# Altium project DigitalBuckBoost.PrjPcb
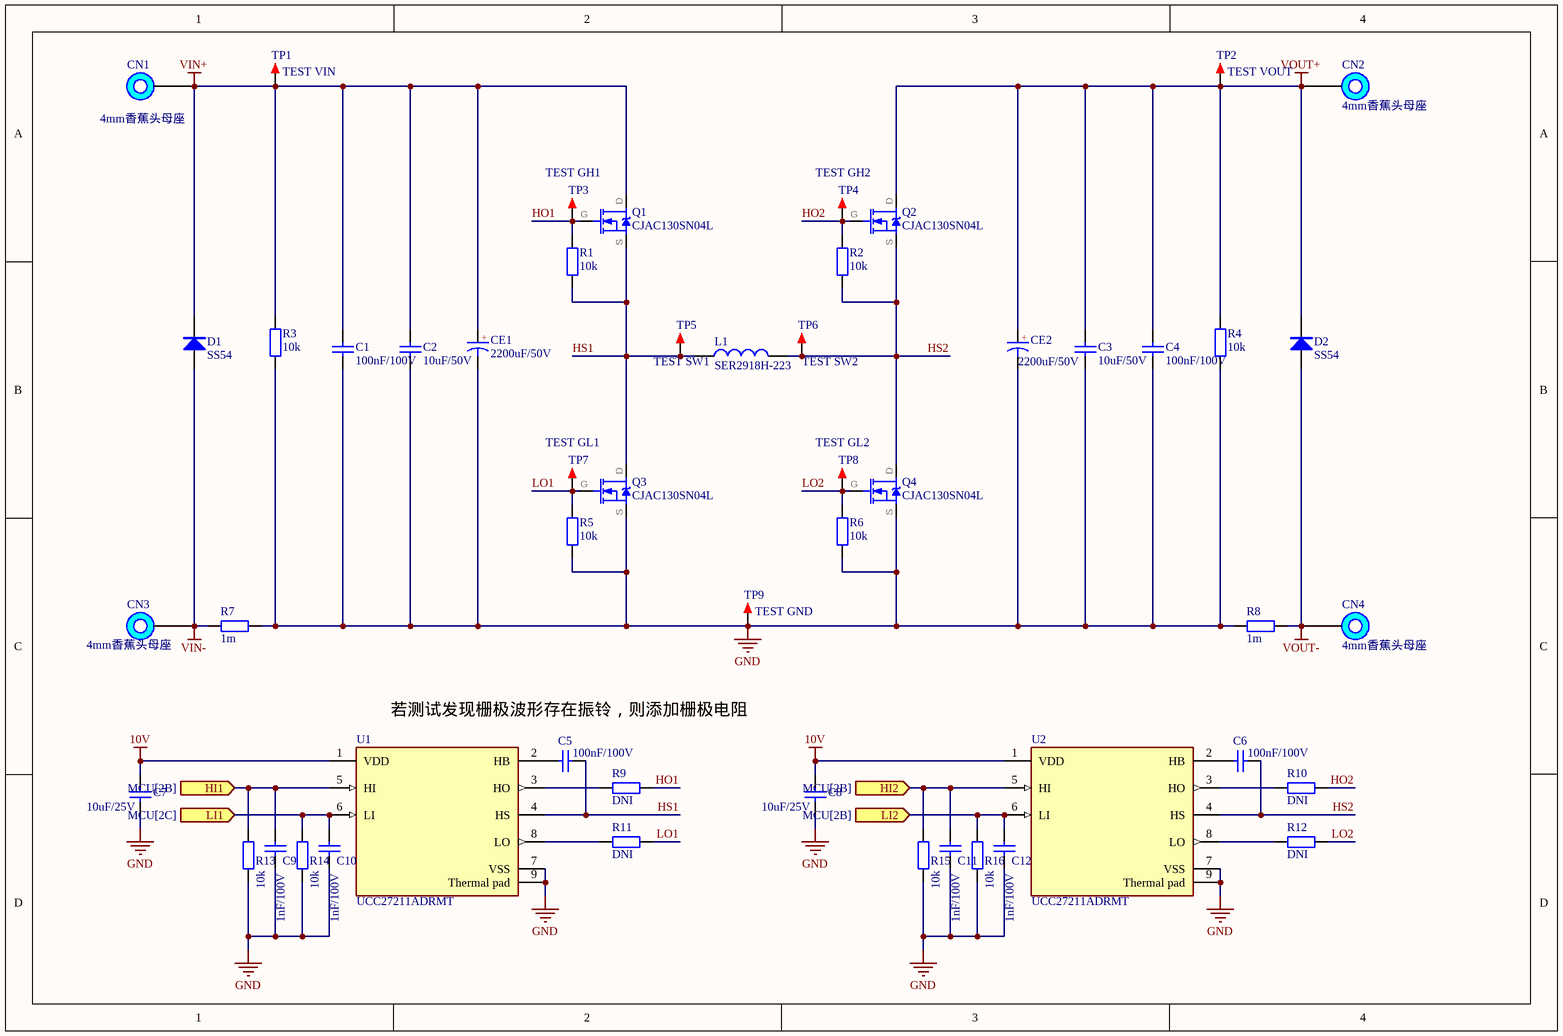
[diagram p0: MainPowerCircuit.SchDoc]
5 sheets, 159 parts. Net scope: flat (ports and power ports of the same name join across sheets).
Board file: DigitalBuckBoost.PcbDoc
Sheets:
  MainPowerCircuit.SchDoc
  AuxiliaryPowerSupply.SchDoc
  MCU.SchDoc
  SignalConditioning.SchDoc
  STLink-V2-1.SchDoc

## Sheet MainPowerCircuit.SchDoc
size A4; SheetNumber: 1; SheetTotal: 5

### Parts
C1  100nF/100V  [C0402_L]
C2  10uF/50V  [C1206_L]
C3  10uF/50V  [C1206_L]
C4  100nF/100V  [C0402_L]
C5  100nF/100V  [C0402_L]
C6  100nF/100V  [C0402_L]
C7  10uF/25V  [C0603_L]
C8  10uF/25V  [C0603_L]
C9  1nF/100V  [C0402_L]
C10  1nF/100V  [C0402_L]
C11  1nF/100V  [C0402_L]
C12  1nF/100V  [C0402_L]
CE1  2200uF/50V  [CE-7.5*16*31.5 - GD]
CE2  2200uF/50V  [CE-7.5*16*31.5 - GD]
CN1  4mm香蕉头母座  [4mm香蕉头母座]
CN2  4mm香蕉头母座  [4mm香蕉头母座]
CN3  4mm香蕉头母座  [4mm香蕉头母座]
CN4  4mm香蕉头母座  [4mm香蕉头母座]
D1  SS54  [SMA]
D2  SS54  [SMA]
L1  SER2918H-223  [SER2918H-223]
Q1  CJAC130SN04L  [PDFNWB5×6-8L]
Q2  CJAC130SN04L  [PDFNWB5×6-8L]
Q3  CJAC130SN04L  [PDFNWB5×6-8L]
Q4  CJAC130SN04L  [PDFNWB5×6-8L]
R1  10k  [R 0402_L]
R2  10k  [R 0402_L]
R3  10k  [R 0402_L]
R4  10k  [R 0402_L]
R5  10k  [R 0402_L]
R6  10k  [R 0402_L]
R7  1m  [R2512_L]
R8  1m  [R2512_L]
R9  DNI  [R 0402_L]
R10  DNI  [R 0402_L]
R11  DNI  [R 0402_L]
R12  DNI  [R 0402_L]
R13  10k  [R 0402_L]
R14  10k  [R 0402_L]
R15  10k  [R 0402_L]
R16  10k  [R 0402_L]
TP1  TEST VIN  [TEST TP1.4_W]
TP2  TEST VOUT  [TEST TP1.4_W]
TP3  TEST GH1  [TEST TP1.4_W]
TP4  TEST GH2  [TEST TP1.4_W]
TP5  TEST SW1  [TEST TP1.4_W]
TP6  TEST SW2  [TEST TP1.4_W]
TP7  TEST GL1  [TEST TP1.4_W]
TP8  TEST GL2  [TEST TP1.4_W]
TP9  TEST GND  [TEST TP1.4_W]
U1  UCC27211ADRMT  [FP-DRM0008A-MFG]
U2  UCC27211ADRMT  [FP-DRM0008A-MFG]

### Ports
HI1 (in, see MCU[2B]), HI2 (in, see MCU[2B]), LI1 (in, see MCU[2C]), LI2 (in, see MCU[2B])

### Nets
10V: C7.2 C8.2 U1.1(VDD) U2.1(VDD)
GND: C1.1 C2.1 C3.1 C4.1 C7.1 C8.1 C9.2 C10.2 C11.2 C12.2 CE1.2 CE2.2 Q3.S Q4.S R3.1 R4.1 R5.1 R6.1 R7.2 R8.1 R13.1 R14.1 R15.1 R16.1 TP9.1 U1.7(VSS) U1.9(Thermal_pad) U2.7(VSS) U2.9(Thermal_pad)
VIN+: C1.2 C2.2 CE1.1 CN1.1 D1.2(K) Q1.D R3.2 TP1.1
VIN-: CN3.1 D1.1(A) R7.1
VOUT+: C3.2 C4.2 CE2.1 CN2.1 D2.2(K) Q2.D R4.2 TP2.1
VOUT-: CN4.1 D2.1(A) R8.2
HO1: Q1.G R1.2 R9.1 TP3.1
HO2: Q2.G R2.2 R10.1 TP4.1
HS1: C5.1 L1.1 Q1.S Q3.D R1.1 TP5.1 U1.4(HS)
HS2: C6.1 L1.2 Q2.S Q4.D R2.1 TP6.1 U2.4(HS)
LO1: Q3.G R5.2 R11.1 TP7.1
LO2: Q4.G R6.2 R12.1 TP8.1
NetC5_2: C5.2 U1.2(HB)
NetC6_2: C6.2 U2.2(HB)
NetC9_1: C9.1 R13.2 U1.5(HI) ; port HI1
NetC10_1: C10.1 R14.2 U1.6(LI) ; port LI1
NetC11_1: C11.1 R15.2 U2.5(HI) ; port HI2
NetC12_1: C12.1 R16.2 U2.6(LI) ; port LI2
NetR9_2: R9.2 U1.3(HO)
NetR10_2: R10.2 U2.3(HO)
NetR11_2: R11.2 U1.8(LO)
NetR12_2: R12.2 U2.8(LO)

### Notes on the sheet
- 若测试发现栅极波形存在振铃，则添加栅极电阻
- (in symbol CE) +

### Library data of the parts
C1-C12 = C: 贴片电容; BOM名称: 无极性贴片电容; 联系卖家，免费查找封装: 唯一出售店铺网址https://shop463601444.taobao.com
CE1 CE2 = CE: 直插电解电容; 联系卖家，免费查找封装: 唯一出售店铺网址https://shop463601444.taobao.com; BOM名称: 直插电解电容
D1 D2 = SS14: 肖特基二极管; 版权归属: 源创客; 属性: 40V/1A; BOM名称: 肖特基二极管; 学习资源: www.ooocke.com
L1 = L: 大电流扁平线电感
Q1-Q4 = CJAC130SN04L: 130A 40V 2.0mΩ@10V N-Channel Power MOSFET
R1-R6 R9-R16 = R: 贴片电阻; 版权归属: 源创客; BOM名称: 贴片电阻; 学习资源: www.ooocke.com
R7 R8 = R: 贴片电阻; 联系卖家，免费查找封装: 唯一出售店铺网址https://shop463601444.taobao.com; BOM名称: 贴片电阻
TP1-TP9 = TEST TP: 测试环; 联系卖家，免费查找封装: 唯一出售店铺网址https://shop463601444.taobao.com; 封装库来自淘宝卖家ID：黄晶宝石: 其他店铺购入均为盗版假冒封装库，请立即申请退款; BOM名称: 测试环
U1 U2 = CMP-2000-07521-2: IC GATE DRVR HALF-BRIDGE 8VSON; Number of Drivers: 2; Number of Outputs: 1; Turn-Off Delay Time: 17ns; Nominal Supply Current: 2.6mA; Max Output Current: 4A; Rise Time: 7.2ns; Channel Type: Independent; Element Configuration: Dual; Max Supply Voltage: 17V; Fall Time: 5.5ns; Max Supply Current: 6.5mA; Min Supply Voltage: 8V; Number of Pins: 8; Radiation Hardening: No; Packaging: Tape and Reel; REACH SVHC: No SVHC; Max Operating Temperature: 140°C; Number of Channels: 2; Min Operating Temperature: -40°C; Turn-On Delay Time: 17ns; RoHS Compliant: Yes; Lead Free: Lead Free; Output Current: 4A; Package Quantity: 250; Mount: Surface Mount

## Sheet AuxiliaryPowerSupply.SchDoc
size A4; SheetNumber: 2; SheetTotal: 5
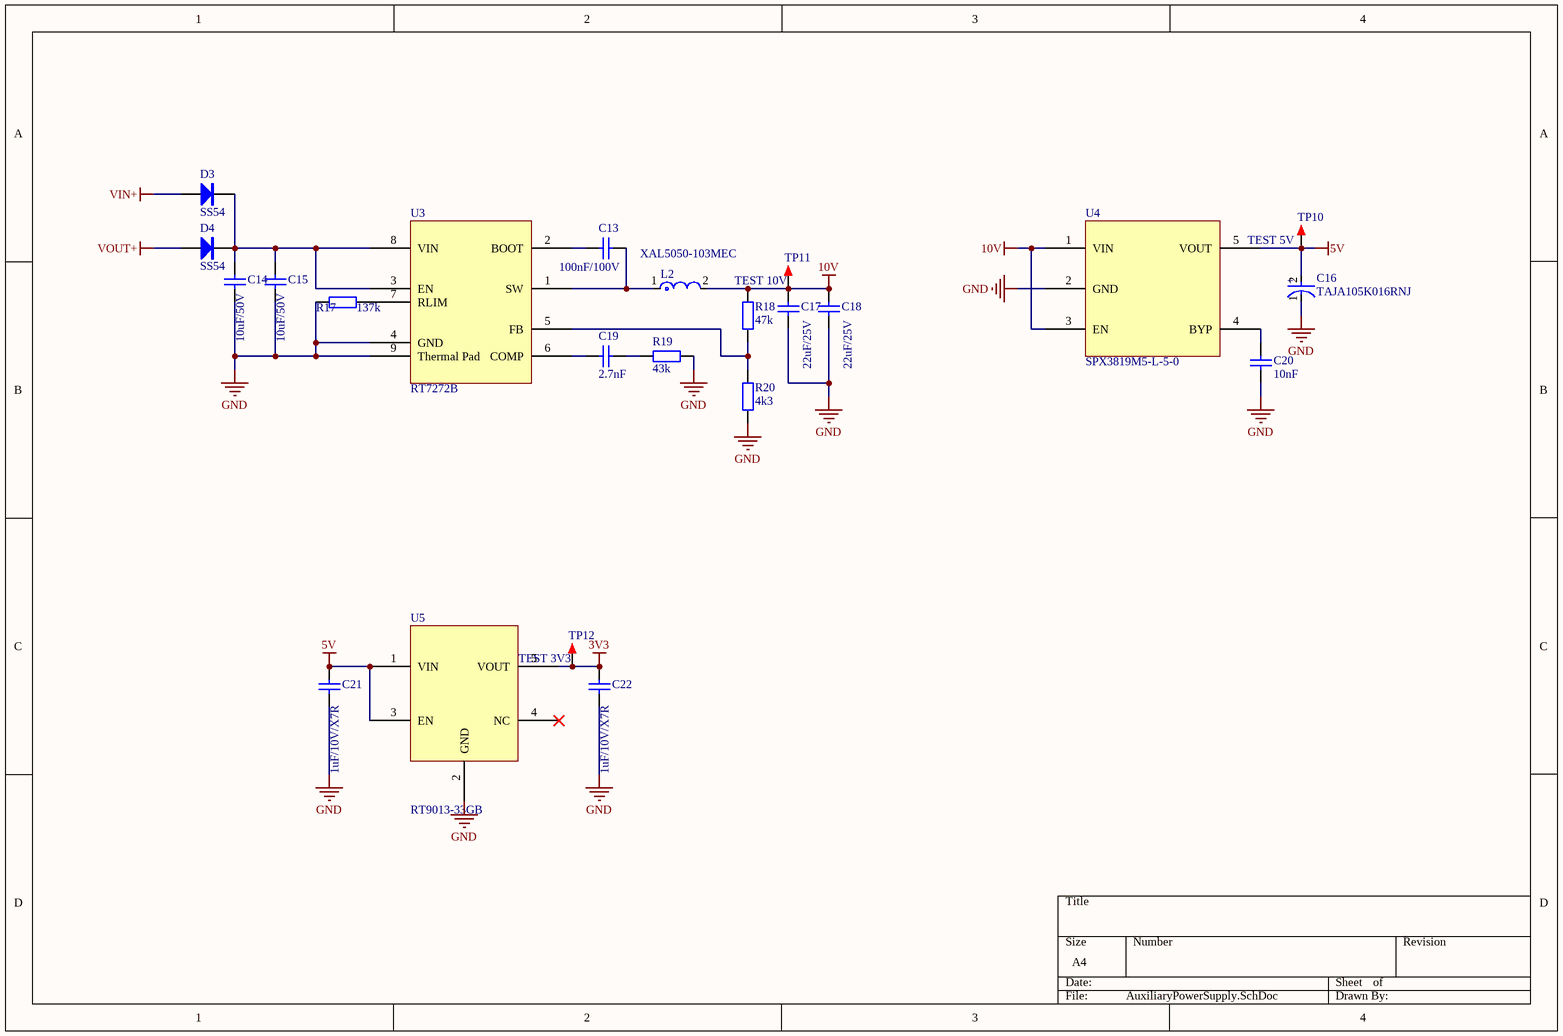
[diagram p1: AuxiliaryPowerSupply.SchDoc]

### Parts
C13  100nF/100V  [C0402_L]
C14  10uF/50V  [C1206_L]
C15  10uF/50V  [C1206_L]
C16  TAJA105K016RNJ  [FP-TAJA-MFG]
C17  22uF/25V  [C0805_L]
C18  22uF/25V  [C0805_L]
C19  2.7nF  [C0402_L]
C20  10nF  [C0402_L]
C21  1uF/10V/X7R  [C0402_L]
C22  1uF/10V/X7R  [C0402_L]
D3  SS54  [SMA]
D4  SS54  [SMA]
L2  XAL5050-103MEC  [FP-XAL5050-MFG]
R17  137k  [R0402_L]
R18  47k  [R0402_L]
R19  43k  [R0402_L]
R20  4k3  [R0402_L]
TP10  TEST 5V  [TEST TP1.4_W]
TP11  TEST 10V  [TEST TP1.4_W]
TP12  TEST 3V3  [TEST TP1.4_W]
U3  RT7272B  [RT7272B]
U4  SPX3819M5-L-5-0  [SPX3819M5-L-5-0]
U5  RT9013-33GB  [RT9013-33GB]

### Nets
3V3: C22.2 TP12.1 U5.5(VOUT)
5V: C16.2(A) C21.2 TP10.1 U4.5(VOUT) U5.1(VIN) U5.3(EN)
10V: C17.2 C18.2 L2.2 R18.1 TP11.1 U4.1(VIN) U4.3(EN)
GND: C14.1 C15.1 C16.1(C) C17.1 C18.1 C20.2 C21.1 C22.1 R17.1 R19.1 R20.1 U3.4(GND) U3.9(Thermal_Pad) U4.2(GND) U5.2(GND)
VIN+: D3.1(A)
VOUT+: D4.1(A)
NetC13_1: C13.1 L2.1 U3.1(SW)
NetC13_2: C13.2 U3.2(BOOT)
NetC14_2: C14.2 C15.2 D3.2(K) D4.2(K) U3.3(EN) U3.8(VIN)
NetC19_1: C19.1 R19.2
NetC19_2: C19.2 U3.6(COMP)
NetC20_1: C20.1 U4.4(BYP)
NetR17_2: R17.2 U3.7(RLIM)
NetR18_2: R18.2 R20.2 U3.5(FB)

Not connected (* = marked no-connect by the designer): U5 4(NC)*

### Notes on the sheet
- (in symbol CMP-04424-000051-2) +

### Library data of the parts
C13-C15 C17-C22 = C: as C1 on sheet MainPowerCircuit
C16 = CMP-04424-000051-2: CAP TANT 1UF 10% 16V 1206; Tolerance: 20%; Dielectric Material: Tantalum; Leakage Current: 500nA; ESR (Equivalent Series Resistance): 11R; Dissipation Factor: 4%; Polarity: Polar; Series: TAJ; Case/Package: 1206; Capacitance: 1uF; Case Code (Metric): 3216; Lead Pitch: 1.1mm; Voltage: 16V; Depth: 1.6mm; Min Operating Temperature: -55°C; Voltage Rating: 16V; Termination: SMD/SMT; Mount: Surface Mount; Number of Pins: 2; Features: General Purpose; Height - Seated (Max): 0.071inch; RoHS Compliant: Yes; Weight: 0.000571oz; Voltage Rating (DC): 16V; Width: 1.6mm; Max Operating Temperature: 125°C; Lead Free: Lead Free; Radiation Hardening: No; REACH SVHC: No SVHC; Packaging: Tape and Reel; Package Quantity: 1; Case Code (Imperial): 1206; Length: 3.2mm; Height: 1.6mm
D3 D4 = SS14: 肖特基二极管; 版权归属: 源创客; 属性: 40V/1A; BOM名称: 肖特基二极管; 学习资源: www.ooocke.com
L2 = CMP-11268-000215-1: Shielded Power Inductors 10uH 20% 4.9A 45mOhm; Self Resonant Frequency: 15MHz; Test Frequency: 100kHz; Core Material: Composite; DC Resistance (DCR): 45mR; Series: XAL5050; Termination: SMD/SMT; Tolerance: 20%; Inductance Tolerance: 20%; RMS Current (Irms): 4.9A; Width: 5.48mm; Mount: Surface Mount; Min Operating Temperature: -40°C; Max Operating Temperature: 125°C; RoHS Compliant: Yes; Saturation Current: 4.9A; Lead Free: Contains Lead; Max DC Current: 4.9A; Shielding: Shielded; Packaging: Tape and Reel; Length: 5.68mm; Package Quantity: 250; Case/Package: SMD/SMT; Inductance: 10uH; Height: 5.1mm; Reach SVHC Compliant: Yes
R17-R20 = R: as R7 on sheet MainPowerCircuit; BOM名称: 贴片电阻
TP10-TP12 = TEST TP: as TP1 on sheet MainPowerCircuit; BOM名称: 测试环

## Sheet MCU.SchDoc
size A4; SheetNumber: 3; SheetTotal: 5
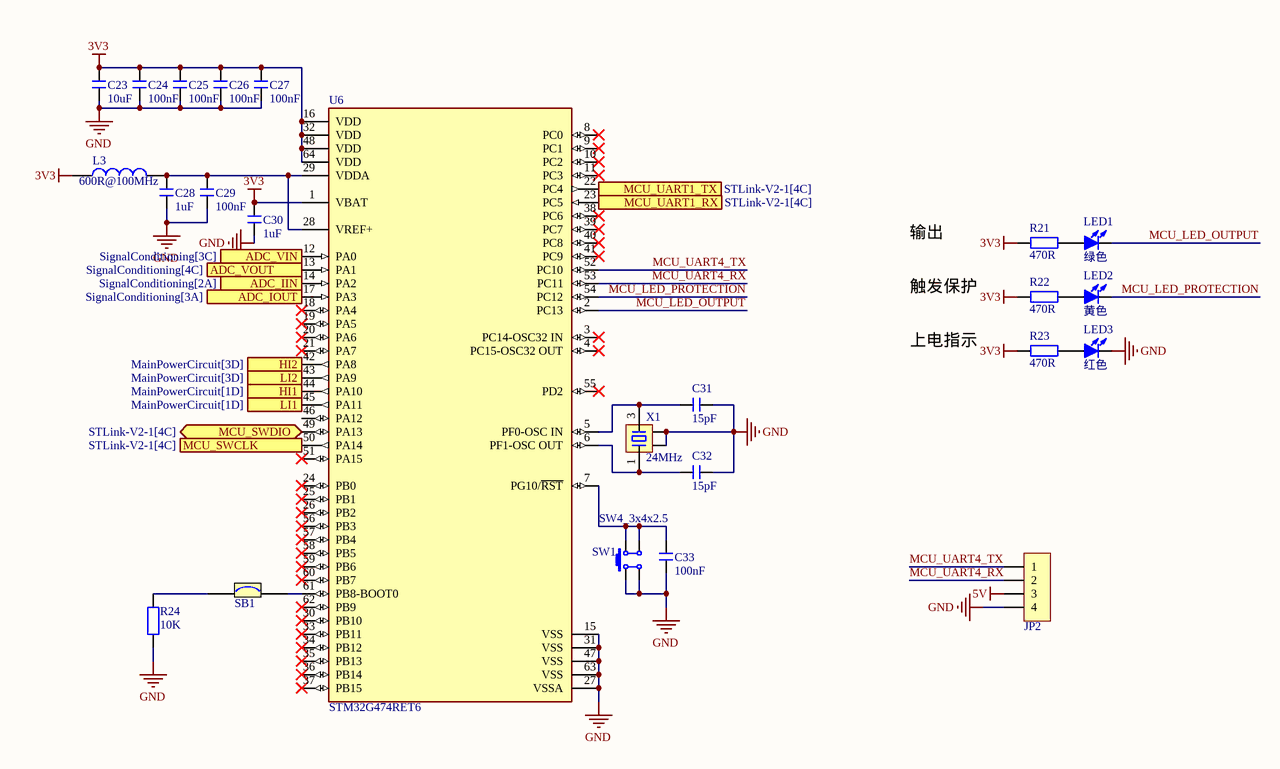
[diagram p2: MCU.SchDoc]

### Parts
C23  10uF  [C 0402_L]
C24  100nF  [C 0402_L]
C25  100nF  [C 0402_L]
C26  100nF  [C 0402_L]
C27  100nF  [C 0402_L]
C28  1uF  [C 0402_L]
C29  100nF  [C 0402_L]
C30  1uF  [C 0402_L]
C31  15pF  [C 0402_L]
C32  15pF  [C 0402_L]
C33  100nF  [C 0402_L]
JP2  HDR-1X4  [XH2.54-WI-4P]  (value not drawn)
L3  600R@100MHz  [L 0603]
LED1  绿色  [LED 0603G]
LED2  黄色  [LED 0603Y]
LED3  红色  [LED 0603R]
R21  470R  [R 0402_L]
R22  470R  [R 0402_L]
R23  470R  [R 0402_L]
R24  10K  [R 0402_L]
SB1  SelectBit  [SelectBit 0402]  (value not drawn)
SW1  SW4_3x4x2.5  [SW4_3x4x2.5]
U6  STM32G474RET6  [FP-LQFP64-5W-MFG]
X1  24MHz  [XTAL-3225-4P]

### Ports
ADC_IIN (in, see SignalConditioning[2A]), ADC_IOUT (in, see SignalConditioning[3A]), ADC_VIN (in, see SignalConditioning[3C]), ADC_VOUT (in, see SignalConditioning[4C]), HI1 (out, see MainPowerCircuit[1D]), HI2 (out, see MainPowerCircuit[3D]), LI1 (out, see MainPowerCircuit[1D]), LI2 (out, see MainPowerCircuit[3D]), MCU_SWCLK (out, see STLink-V2-1[4C]), MCU_SWDIO (bidir, see STLink-V2-1[4C]), MCU_UART1_RX (in, see STLink-V2-1[4C]), MCU_UART1_TX (out, see STLink-V2-1[4C])

### Nets
3V3: C23.2 C24.2 C25.2 C26.2 C27.2 C30.2 L3.1 R21.2 R22.2 R23.2 U6.1(VBAT) U6.16(VDD) U6.32(VDD) U6.48(VDD) U6.64(VDD)
5V: JP2.3
GND: C23.1 C24.1 C25.1 C26.1 C27.1 C28.1 C29.1 C30.1 C31.1 C32.1 C33.2 JP2.4 LED3.2(K) R24.2 SW1.1 SW1.2 U6.15(VSS) U6.27(VSSA) U6.31(VSS) U6.47(VSS) U6.63(VSS) X1.2 X1.4
MCU_LED_OUTPUT: LED1.2(K) U6.2(PC13)
MCU_LED_PROTECTION: LED2.2(K) U6.54(PC12)
MCU_UART4_RX: JP2.2 U6.53(PC11)
MCU_UART4_TX: JP2.1 U6.52(PC10)
NetC9_1: U6.44(PA10) ; port HI1
NetC10_1: U6.45(PA11) ; port LI1
NetC11_1: U6.42(PA8) ; port HI2
NetC12_1: U6.43(PA9) ; port LI2
NetC28_2: C28.2 C29.2 L3.2 U6.28(VREF+) U6.29(VDDA)
NetC31_2: C31.2 U6.5(PF0-OSC_IN) X1.3
NetC32_2: C32.2 U6.6(PF1-OSC_OUT) X1.1
NetC33_1: C33.1 SW1.3 SW1.4 U6.7(PG10/~{RST})
NetLED1_1: LED1.1(A) R21.1
NetLED2_1: LED2.1(A) R22.1
NetLED3_1: LED3.1(A) R23.1
NetR24_1: R24.1 SB1.1
NetR33_1: U6.12(PA0) ; port ADC_VIN
NetR34_1: U6.13(PA1) ; port ADC_VOUT
NetR50_1: U6.50(PA14) ; port MCU_SWCLK
NetR51_1: U6.49(PA13) ; port MCU_SWDIO
NetR52_1: U6.23(PC5) ; port MCU_UART1_RX
NetR53_1: U6.22(PC4) ; port MCU_UART1_TX
NetSB1_2: SB1.2 U6.61(PB8-BOOT0)
NetU6_14: U6.14(PA2) ; port ADC_IIN
NetU6_17: U6.17(PA3) ; port ADC_IOUT

Not connected (* = marked no-connect by the designer): U6 3(PC14-OSC32_IN)* 4(PC15-OSC32_OUT)* 8(PC0)* 9(PC1)* 10(PC2)* 11(PC3)* 18(PA4)* 19(PA5)* 20(PA6)* 21(PA7)* 24(PB0)* 25(PB1)* 26(PB2)* 30(PB10)* 33(PB11)* 34(PB12)* 35(PB13)* 36(PB14)* 37(PB15)* 38(PC6)* 39(PC7)* 40(PC8)* 41(PC9)* 46(PA12) 51(PA15)* 55(PD2)* 56(PB3)* 57(PB4)* 58(PB5)* 59(PB6)* 60(PB7)* 62(PB9)*

### Notes on the sheet
- 输出
- 触发保护
- 上电指示

### Library data of the parts
C23-C33 = C: 无极性贴片电容; 版权归属: 源创客; BOM名称: 无极性贴片电容; 学习资源: www.ooocke.com
JP2 = Header 4: 4P接插件; 封装库来自淘宝卖家 ID：黄晶宝石: 其他店铺购入均为盗版假冒封装库; 联系卖家，免费查找封装: 唯一出售店铺网址https://shop463601444.taobao.com; BOM名称: 4P接插件
L3 = L: 小功率贴片电感; 版权归属: 源创客; BOM名称: 小功率贴片电感; 学习资源: www.ooocke.com
LED1-LED3 = LED-SMD: 贴片LED; 版权归属: 源创客; BOM名称: 贴片LED; 学习资源: www.ooocke.com
R21-R24 = R: 贴片电阻; 版权归属: 源创客; BOM名称: 贴片电阻; 学习资源: www.ooocke.com
SB1 = SelectBit: 跨接桥，用于选择不同的模式，可以用锡连上，或者焊上0R电阻
U6 = CMP-12105-000051-1: MAINSTREAM ARM CORTEX-M4 CORE WI; Manufacturer: STMicroelectronics; Ram Size: 128KBytes; Interface: I2C,SPI,UART,USART,CAN,USB,LIN,IrDA,I2S,SMBus,Other; Number Of I2C Channels: 4; Number Of A/D Converters: 5; Number Of Timers/Counters: 14; Number Of I/Os: 52; Max Supply Voltage: 3.6V; Memory Size: 512KBytes; Number Of Adc Channels: 26; Number Of Cores: 1; Min Supply Voltage: 1.71V; Max Junction Temp: +105°C; Standoff Height: 0.05mm; Number Of Uart Channels: 6; Number Of Spi Channels: 3; Frequency: 170MHz; Data Bus Width: 32bits; Memory Type: FLASH; Number Of Pwm Channels: 32; Package: LQFP64-5W; Manufacturer Part Number: STM32G474RET6; Height: 1.6mm; Mouser Description: Microcontroller 32-Bit ARM Cortex-M4 RISC 512KB Flash 1.71V to 3.6V 64-Pin LQFP; Temperature Range High: +105°C; Octopart: https://octopart.com/stm32g474ret6-stmicroelectronics-102308483; Category: IC; Automotive: No; ComponentLink2URL: https://www.st.com/resource/en/datasheet/stm32g474cb.pdf; Temperature Range Low: -40°C; Device Class L1: Integrated Circuits (ICs); Device Class L2: Embedded Processors and Controllers; Core Architecture: ARM Cortex-M4; Ambient Temperature Range Low: -40°C; ComponentLink2Description: Datasheet; Temperature: -40°C to +105°C; Digikey Description: MAINSTREAM ARM CORTEX-M4 CORE WI; Lead Free: Yes; RoHS: TRUE; Ambient Temperature Range High: +85°C; Device Class L3: Microcontrollers; Number Of Usb Channels: 1
X1 = XTAL-4P: 4脚无源晶振(谐振器）; 联系卖家，免费查找封装: 唯一出售店铺网址https://shop463601444.taobao.com; BOM名称: 4脚无源晶振(谐振器）

## Sheet SignalConditioning.SchDoc
size A4; SheetNumber: 4; SheetTotal: 5
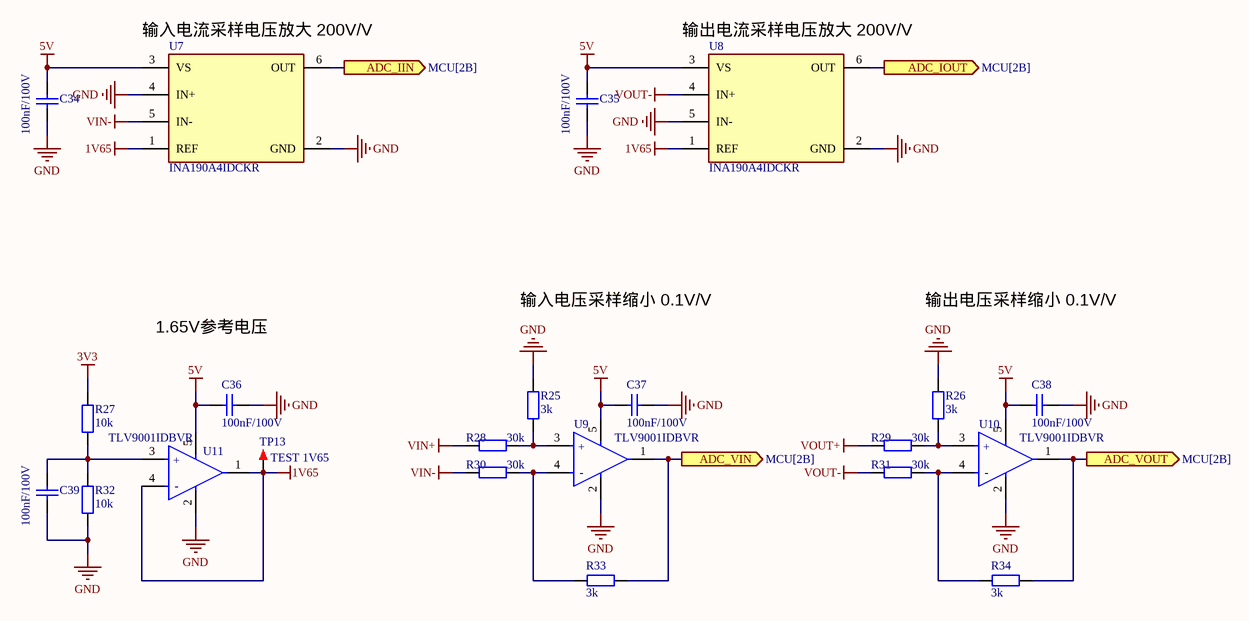
[diagram p3: SignalConditioning.SchDoc]

### Parts
C34  100nF/100V  [C0402_L]
C35  100nF/100V  [C0402_L]
C36  100nF/100V  [C0402_L]
C37  100nF/100V  [C0402_L]
C38  100nF/100V  [C0402_L]
C39  100nF/100V  [C0402_L]
R25  3k  [R 0402_L]
R26  3k  [R 0402_L]
R27  10k  [R 0402_L]
R28  30k  [R 0402_L]
R29  30k  [R 0402_L]
R30  30k  [R 0402_L]
R31  30k  [R 0402_L]
R32  10k  [R 0402_L]
R33  3k  [R 0402_L]
R34  3k  [R 0402_L]
TP13  TEST 1V65  [TEST TP1.4_W]
U7  INA190A4IDCKR  [FP-DCK0006A-IPC_C]
U8  INA190A4IDCKR  [FP-DCK0006A-IPC_C]
U9  TLV9001IDBVR  [FP-DBV0005A-IPC_B]
U10  TLV9001IDBVR  [FP-DBV0005A-IPC_B]
U11  TLV9001IDBVR  [FP-DBV0005A-IPC_B]

### Ports
ADC_IIN (out, see MCU[2B]), ADC_IOUT (out, see MCU[2B]), ADC_VIN (out, see MCU[2B]), ADC_VOUT (out, see MCU[2B])

### Nets
1V65: TP13.1 U7.1(REF) U8.1(REF) U11.1(OUT) U11.4(IN-)
3V3: R27.2
5V: C34.2 C35.2 C36.2 C37.2 C38.2 U7.3(VS) U8.3(VS) U9.5(V+) U10.5(V+) U11.5(V+)
GND: C34.1 C35.1 C36.1 C37.1 C38.1 C39.1 R25.2 R26.2 R32.1 U7.2(GND) U7.4(IN+) U8.2(GND) U8.5(IN-) U9.2(V-) U10.2(V-) U11.2(V-)
VIN+: R28.2
VIN-: R30.2 U7.5(IN-)
VOUT+: R29.2
VOUT-: R31.2 U8.4(IN+)
NetC39_2: C39.2 R27.1 R32.2 U11.3(IN+)
NetR25_1: R25.1 R28.1 U9.3(IN+)
NetR26_1: R26.1 R29.1 U10.3(IN+)
NetR30_1: R30.1 R33.2 U9.4(IN-)
NetR31_1: R31.1 R34.2 U10.4(IN-)
NetR33_1: R33.1 U9.1(OUT) ; port ADC_VIN
NetR34_1: R34.1 U10.1(OUT) ; port ADC_VOUT
NetU6_14: U7.6(OUT) ; port ADC_IIN
NetU6_17: U8.6(OUT) ; port ADC_IOUT

### Notes on the sheet
- (near U7) 输入电流采样电压放大 200V/V
- (near U8) 输出电流采样电压放大 200V/V
- 1.65V参考电压
- 输入电压采样缩小 0.1V/V
- 输出电压采样缩小 0.1V/V
- (in symbol CMP-04895-000230-1) +; -

### Library data of the parts
C34-C39 = C: as C1 on sheet MainPowerCircuit
R25-R34 = R: 贴片电阻; 版权归属: 源创客; BOM名称: 贴片电阻; 学习资源: www.ooocke.com
TP13 = TEST TP: as TP1 on sheet MainPowerCircuit; BOM名称: 测试环
U7 U8 = CMP-04895-000472-1: IC CURR SENSE 1 CIRCUIT SC70-6
U9-U11 = CMP-04895-000230-1: IC CMOS 1 CIRCUIT SOT23-5; Output Current per Channel: 40mA; Input Bias Current: 5pA; Number of Circuits: 1; Operating Supply Current: 60uA; Input Offset Voltage (Vos): 400uV; Gain Bandwidth Product: 1MHz; Slew Rate: 2V/µs; Packaging: Tape and Reel; RoHS Compliant: Yes; Mount: Surface Mount; Max Operating Temperature: 125°C; Min Operating Temperature: -40°C; Case/Package: SOT-23-6

## Sheet STLink-V2-1.SchDoc
size A4; SheetNumber: 5; SheetTotal: 5
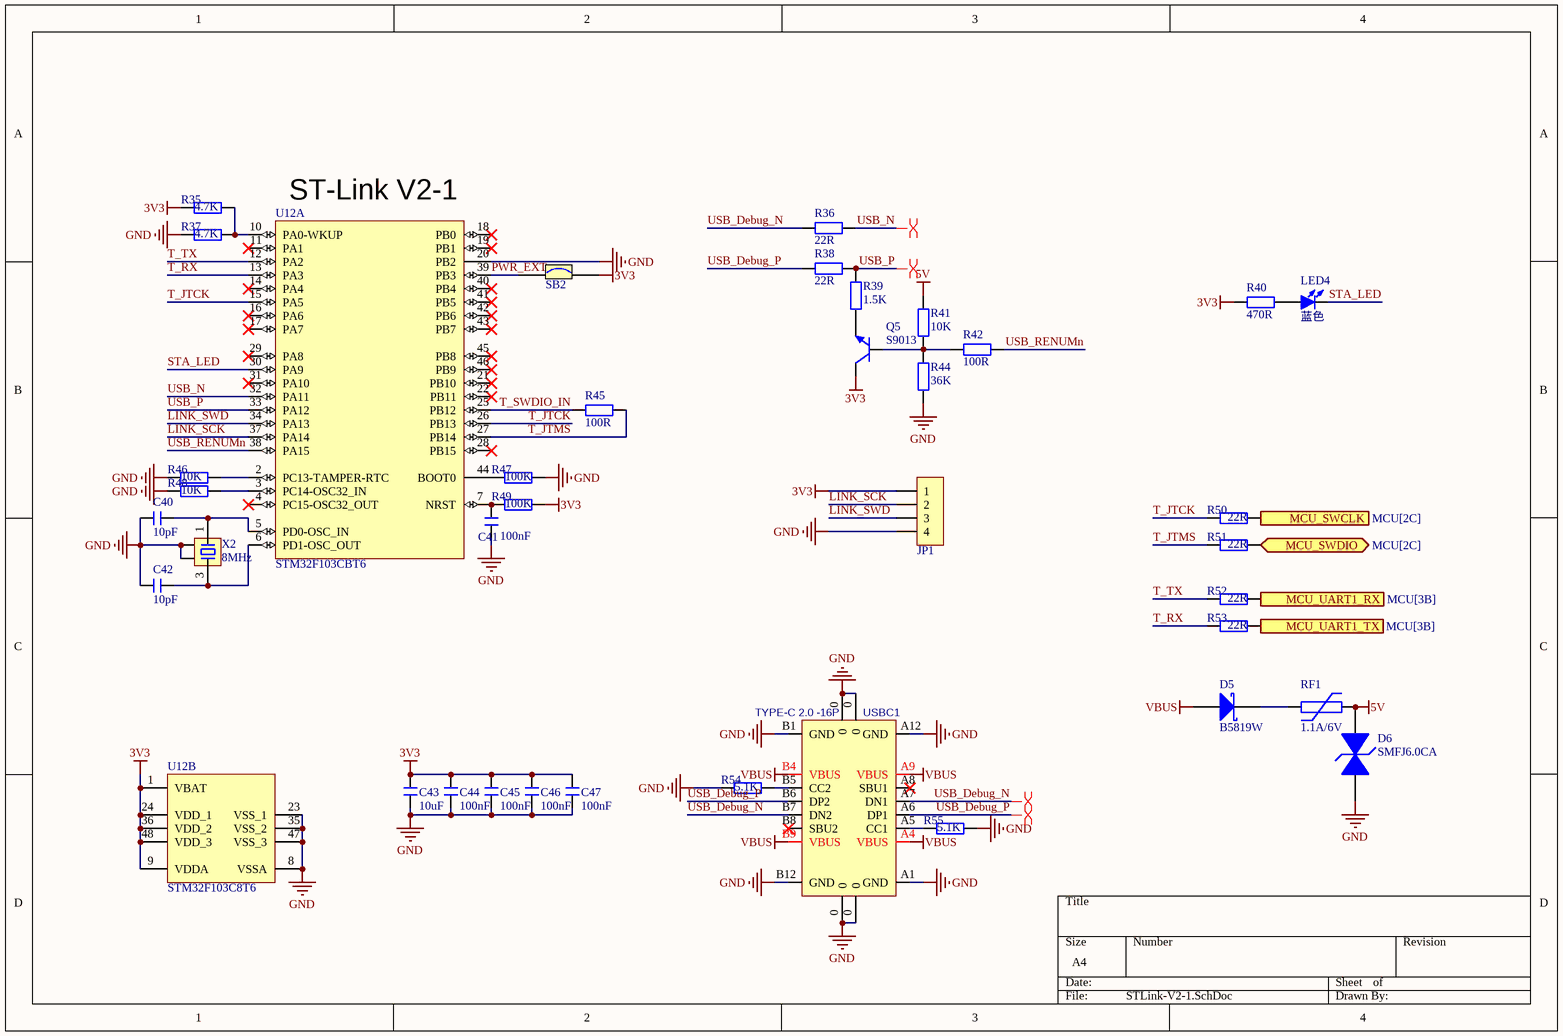
[diagram p4: STLink-V2-1.SchDoc]

### Parts
C40  10pF  [C 0402_L]
C41  100nF  [C 0402_L]
C42  10pF  [C 0402_L]
C43  10uF  [C 0402_L]
C44  100nF  [C 0402_L]
C45  100nF  [C 0402_L]
C46  100nF  [C 0402_L]
C47  100nF  [C 0402_L]
D5  B5819W  [MCC-SOD123_V]
D6  SMFJ6.0CA  [SMFJ6.0CA]
JP1  HDR-1X4  [HDR2.54-LI-4P]  (value not drawn)
LED4  蓝色  [LED 0603B]
Q5  S9013  [SOT23-3L]
R35  4.7K  [R 0402_L]
R36  22R  [R 0402_L]
R37  4.7K  [R 0402_L]
R38  22R  [R 0402_L]
R39  1.5K  [R 0402_L]
R40  470R  [R 0402_L]
R41  10K  [R 0402_L]
R42  100R  [R 0402_L]
R44  36K  [R 0402_L]
R45  100R  [R 0402_L]
R46  10K  [R 0402_L]
R47  100K  [R 0402_L]
R48  10K  [R 0402_L]
R49  100K  [R 0402_L]
R50  22R  [R 0402_L]
R51  22R  [R 0402_L]
R52  22R  [R 0402_L]
R53  22R  [R 0402_L]
R54  5.1K  [R 0402_L]
R55  5.1K  [R 0402_L]
RF1  1.1A/6V  [MF-NSMF110-2]
SB2  SelectBit  [SelectBit 0402]  (value not drawn)
U12  STM32F103CBT6  [STM-LQFP48_L]  (parts A,B of 2)
USBC1  TYPE-C 2.0 -16P  [USB-C-SMD_16P]
X2  8MHz  [XTAL-3225-4P]

### Ports
MCU_SWCLK (in, see MCU[2C]), MCU_SWDIO (bidir, see MCU[2C]), MCU_UART1_RX (out, see MCU[3B]), MCU_UART1_TX (in, see MCU[3B])

### Nets
3V3: C43.2 C44.2 C45.2 C46.2 C47.2 JP1.1 Q5.3(C) R35.1 R40.2 R49.1 SB2.2 U12.1(VBAT) U12.9(VDDA) U12.24(VDD_1) U12.36(VDD_2) U12.48(VDD_3)
5V: D6.2 R41.2 RF1.2
GND: C40.2 C41.1 C42.2 C43.1 C44.1 C45.1 C46.1 C47.1 D6.1 JP1.4 R37.1 R44.1 R46.2 R47.1 R48.2 R54.2 R55.1 U12.8(VSSA) U12.20(PB2) U12.23(VSS_1) U12.35(VSS_2) U12.47(VSS_3) USBC1.0 USBC1.A1(GND) USBC1.A12(GND) USBC1.B1(GND) USBC1.B12(GND) X2.2 X2.4
VBUS: D5.1(A) USBC1.A4(VBUS) USBC1.A9(VBUS) USBC1.B4(VBUS) USBC1.B9(VBUS)
LINK_SCK: JP1.2 U12.37(PA14)
LINK_SWD: JP1.3 U12.34(PA13)
PWR_EXT: SB2.1 U12.39(PB3)
STA_LED: LED4.2(K) U12.30(PA9)
T_JTCK: R50.2 U12.15(PA5) U12.26(PB13)
T_JTMS: R45.1 R51.2 U12.27(PB14)
T_RX: R53.2 U12.13(PA3)
T_SWDIO_IN: R45.2 U12.25(PB12)
T_TX: R52.2 U12.12(PA2)
USB_Debug_N: R36.1 USBC1.A7(DN1) USBC1.B7(DN2)
USB_Debug_P: R38.1 USBC1.A6(DP1) USBC1.B6(DP2)
USB_N: R36.2 U12.32(PA11)
USB_P: R38.2 R39.2 U12.33(PA12)
USB_RENUMn: R42.1 U12.38(PA15)
NetC40_1: C40.1 U12.5(PD0-OSC_IN) X2.1
NetC41_2: C41.2 R49.2 U12.7(NRST)
NetC42_1: C42.1 U12.6(PD1-OSC_OUT) X2.3
NetD5_2: D5.2(K) RF1.1
NetLED4_1: LED4.1(A) R40.1
NetQ5_1: Q5.1(B) R41.1 R42.2 R44.2
NetQ5_2: Q5.2(E) R39.1
NetR35_2: R35.2 R37.2 U12.10(PA0-WKUP)
NetR46_1: R46.1 U12.2(PC13-TAMPER-RTC)
NetR47_2: R47.2 U12.44(BOOT0)
NetR48_1: R48.1 U12.3(PC14-OSC32_IN)
NetR50_1: R50.1 ; port MCU_SWCLK
NetR51_1: R51.1 ; port MCU_SWDIO
NetR52_1: R52.1 ; port MCU_UART1_RX
NetR53_1: R53.1 ; port MCU_UART1_TX
NetR54_1: R54.1 USBC1.B5(CC2)
NetR55_2: R55.2 USBC1.A5(CC1)

Not connected (* = marked no-connect by the designer): U12 4(PC15-OSC32_OUT)* 11(PA1)* 14(PA4)* 16(PA6)* 17(PA7)* 18(PB0)* 19(PB1)* 21(PB10)* 22(PB11)* 28(PB15)* 29(PA8)* 31(PA10)* 40(PB4)* 41(PB5)* 42(PB6)* 43(PB7)* 45(PB8)* 46(PB9)*; USBC1 A8(SBU1)* B8(SBU2)*

### Layout directives
differential pair: USB_Debug_N, USB_Debug_P, USB_N, USB_P

### Notes on the sheet
- (near U12) ST-Link V2-1

### Library data of the parts
C40-C47 = C: 无极性贴片电容; 版权归属: 源创客; BOM名称: 无极性贴片电容; 学习资源: www.ooocke.com
D5 = CMP-2100-03587-1: Schottky Barrier Rectifier, 1 A, 40 Vrm, -65 to 125 degC, 2-Pin SOD123, RoHS, Tape and Reel; Manufacturer: Micro Commercial Components; Package Description: 2-Pin Small Outline Diode, Body 2.7 x 1.6 mm, Height 1.35 mm; Datasheet URL: http://www.mccsemi.com/up_pdf/B5817W-B5819W(SOD-123).pdf; Manufacturer URL: http://www.mccsemi.com/; Package Reference: SOD123; Package URL: http://www.mccsemi.com/up_pdf/1N4448W(SOD-123).pdf; Datasheet Version: Rev. B, 01/2013
D6 = SMFJ6.0CA: 贴片TVS瞬变抑制二极管
JP1 = Header 4: as JP2 on sheet MCU; BOM名称: 4P接插件
LED4 = LED-SMD: 贴片LED; 版权归属: 源创客; BOM名称: 贴片LED; 学习资源: www.ooocke.com
Q5 = 9013-SMD: 低频放大-NPN型; 版权归属: 源创客; 属性: 50V?0.5A?0.625W; BOM名称: 低频放大-NPN型; 学习资源: www.ooocke.com
R35-R42 R44-R55 = R: 贴片电阻; 版权归属: 源创客; BOM名称: 贴片电阻; 学习资源: www.ooocke.com
RF1 = PPTC: PPTC自恢复保险丝; 版权归属: 源创客; BOM名称: PPTC自恢复保险丝; 学习资源: www.ooocke.com
SB2 = SelectBit: 跨接桥，用于选择不同的模式，可以用锡连上，或者焊上0R电阻
U12 = CMP-0237-00215-3: ARM Cortex-M3 32-bit MCU, 64 KB Flash, 20 KB Internal RAM, 37 I/Os, 48-pin LQFP, -40 to 85 degC, Tray; PartNumber: STM32F103C8T6; Supply Voltage(Vcc) min (V): 2; Internal RAM Size (kB): 20; FLASH Size (Prog) (kB): 64; A/D Converter: 2x12-bit (10 Channel); I/Os (High Current): 37; Operating Frequency(F) (Processor speed) (MHz): 72; Core: ARM Cortex-M3; ComponentLink3Description: Package Specification; Mounting Technology: Surface Mount; PackageReference: LQFP48; Packing: Tray; ComponentLink3URL: http://www.st.com/st-web-ui/static/active/en/resource/technical/document/datasheet/DM00058181.pdf; DatasheetVersion: Rev. 16; ComponentLink1URL: http://www.st.com/web/en/home.html; PackageVersion: Rev. 6, 06/2013; ComponentLink2URL: http://www.st.com/st-web-ui/static/active/en/resource/technical/document/datasheet/CD00161566.pdf; ComponentLink1Description: Manufacturer URL; ComponentLink2Description: Datasheet; PackageDescription: 48-Pin Low Profile Quad Flat Package, 7 x 7 mm Body, 0.5 mm Pitch
USBC1 = USB2.0_Type-C_16Pin: USB2.0_Type-C_16Pin母座; 联系卖家 免费查找封装: 唯一出售店铺网址https://shop463601444.taobao.com; 联系卖家 免费技术支持: 封装库来自淘宝卖家ID：黄晶宝石
X2 = XTAL-4P: as X1 on sheet MCU; BOM名称: 4脚无源晶振(谐振器）

## Nets that join several sheets
3V3: AuxiliaryPowerSupply (C22.2 TP12.1 U5.5), MCU (15 pins), SignalConditioning (R27.2), STLink-V2-1 (16 pins)
5V: AuxiliaryPowerSupply (6 pins), MCU (JP2.3), SignalConditioning (10 pins), STLink-V2-1 (D6.2 R41.2 RF1.2)
10V: MainPowerCircuit (C7.2 C8.2 U1.1 U2.1), AuxiliaryPowerSupply (7 pins)
GND: MainPowerCircuit (29 pins), AuxiliaryPowerSupply (15 pins), MCU (23 pins), SignalConditioning (16 pins), STLink-V2-1 (29 pins)
VIN+: MainPowerCircuit (8 pins), AuxiliaryPowerSupply (D3.1), SignalConditioning (R28.2)
VIN-: MainPowerCircuit (CN3.1 D1.1 R7.1), SignalConditioning (R30.2 U7.5)
VOUT+: MainPowerCircuit (8 pins), AuxiliaryPowerSupply (D4.1), SignalConditioning (R29.2)
VOUT-: MainPowerCircuit (CN4.1 D2.1 R8.2), SignalConditioning (R31.2 U8.4)
NetC9_1: MainPowerCircuit (C9.1 R13.2 U1.5), MCU (U6.44)
NetC10_1: MainPowerCircuit (C10.1 R14.2 U1.6), MCU (U6.45)
NetC11_1: MainPowerCircuit (C11.1 R15.2 U2.5), MCU (U6.42)
NetC12_1: MainPowerCircuit (C12.1 R16.2 U2.6), MCU (U6.43)
NetR33_1: MCU (U6.12), SignalConditioning (R33.1 U9.1)
NetR34_1: MCU (U6.13), SignalConditioning (R34.1 U10.1)
NetR50_1: MCU (U6.50), STLink-V2-1 (R50.1)
NetR51_1: MCU (U6.49), STLink-V2-1 (R51.1)
NetR52_1: MCU (U6.23), STLink-V2-1 (R52.1)
NetR53_1: MCU (U6.22), STLink-V2-1 (R53.1)
NetU6_14: MCU (U6.14), SignalConditioning (U7.6)
NetU6_17: MCU (U6.17), SignalConditioning (U8.6)